# EAGLE design Amp Relay (EAGLE 9.4.0)
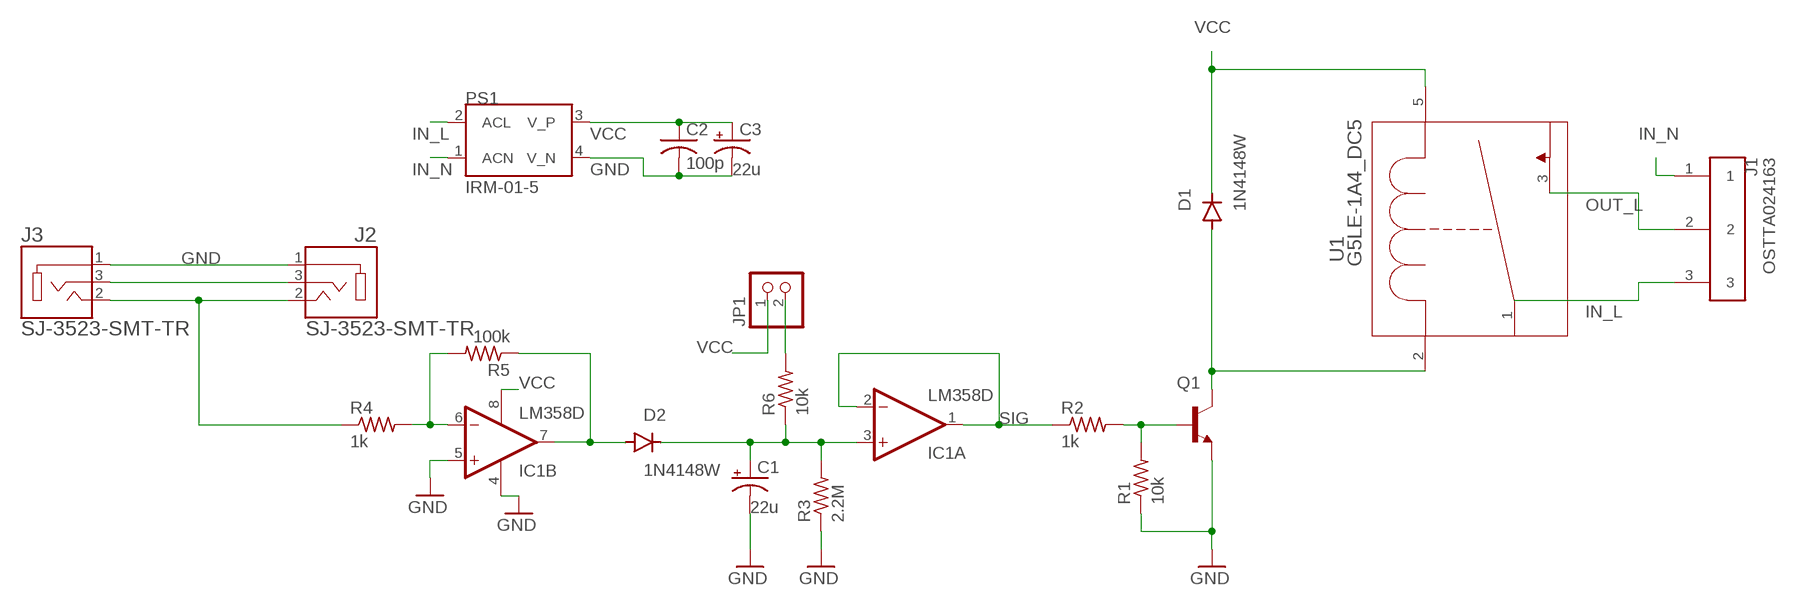
[diagram p0: schematic, sheet 1]

## Parts
C1  WE-CAP  [WE-CAP]
C2  100p  C-USC0805  [C0805]
C3  WE-CAP  [WE-CAP]
D1  1N4148W  DIODE-SOD123  [SOD123]
D2  1N4148W  DIODE-SOD123  [SOD123]
IC1  LM358D  [SO08]
J1  OSTTA024163  [OSTTA024163]
J2  SJ-3523-SMT-TR  [CUI_SJ-3523-SMT-TR]
J3  SJ-3523-SMT-TR  [CUI_SJ-3523-SMT-TR]
JP1  PINHD-1X2  [1X02]
PS1  IRM-01-5  [CONV_IRM-01-5]
Q1  BC849SMD  [SOT23-BEC]
R1  10k  R-US_R1206  [R1206]
R2  1k  R-US_R0805  [R0805]
R3  2.2M  R-US_R1206  [R1206]
R4  1k  R-US_R0805  [R0805]
R5  100k  R-US_R1206  [R1206]
R6  10k  R-US_R1206  [R1206]
U1  G5LE-1A4_DC5  [RELAY_G5LE-1A]

## Nets
B: Q1.B R1.2 R2.2
C: D1.A Q1.C U1.2
GND: C1.- C2.2 C3.- IC1.4(P:V-) IC1.5(B:+IN) J2.1 J3.1 PS1.4(V_N) Q1.E R1.1 R3.1
IN_L: J1.3 PS1.2(ACL) U1.1
IN_N: J1.1 PS1.1(ACN)
N$1: JP1.2 R6.2
N$2: J2.2 J3.2 R4.1
N$3: IC1.6(B:-IN) R4.2 R5.2
N$4: D2.A IC1.7(B:OUT) R5.1
N$5: C1.+ D2.C IC1.3(A:+IN) R3.2 R6.1
N$6: J2.3 J3.3
OUT_L: J1.2 U1.3
SIG: IC1.1(A:OUT) IC1.2(A:-IN) R2.1
VCC: C2.1 C3.+ D1.C IC1.8(P:V+) JP1.1 PS1.3(V_P) U1.5

## Library data of the parts
C1 C3 = my_lib:WE-CAP; C: 22u
C2 = rcl:C-US: CAPACITOR, American symbol; SPICEPREFIX: C
D1 D2 = diode:DIODE-: DIODE
IC1 = linear:LM358: OP AMP also LM158; LM258; LM2904 Source: http://cache.national.com/ds/LM/LM158.pdf
J1 = my_lib:OSTTA024163: 3-pin terminal block
J2 J3 = my_lib:SJ-3523-SMT-TR: Audio Jack Connector 3.5 mm Low Profile Surface Mount Stereo Jack, 3 Pin Right-Angle; CUI_PURCHASE_URL: https://www.cui.com/product/interconnect/audio-connectors/3.5-mm-jacks/sj-352x-smt-series?utm_source=snapeda.com&utm_medium=referral&utm_campaign=snapedaBOM; DESCRIPTION: SJ Series 3.5 mm 12 V SMT Right Angle Stereo Audio Jack; DIGI-KEY_PART_NUMBER: CP-3523SJCT-ND; DIGI-KEY_PURCHASE_URL: https://www.digikey.com/product-detail/en/cui-inc/SJ-3523-SMT-TR/CP-3523SJCT-ND/669704?utm_source=snapeda&utm_medium=aggregator&utm_campaign=symbol; MF: CUI Inc.; MP: SJ-3523-SMT-TR; PACKAGE: LGA-10 STMicroelectronics
JP1 = pinhead:PINHD-1X2: PIN HEADER
PS1 = my_lib:IRM-01-5: AC-DC Single Output Encapsulated power supply; Input 85-305Vac; Output 5Vdc at 0.2A; PCB mount; DESCRIPTION: AC-DC Single Output Encapsulated power supply; Input 85-305Vac; Output 5Vdc at 0.2A; PCB mount; DIGI-KEY_PART_NUMBER: 1866-2998-ND; DIGI-KEY_PURCHASE_URL: https://www.digikey.com/product-detail/en/mean-well-usa-inc/IRM-01-5/1866-2998-ND/7704616?utm_source=snapeda&utm_medium=aggregator&utm_campaign=symbol; MF: MEAN WELL; MP: IRM-01-5; PACKAGE: DIP-4 Mean Well
Q1 = transistor-npn:BC849*: NPN Transistor
R1-R6 = rcl:R-US_: RESISTOR, American symbol; SPICEPREFIX: R
U1 = my_lib:G5LE-1A4_DC5; MANUFACTURER_PART_NUMBER: G5LE1A4 DC5; VENDOR: OMRON

## Board
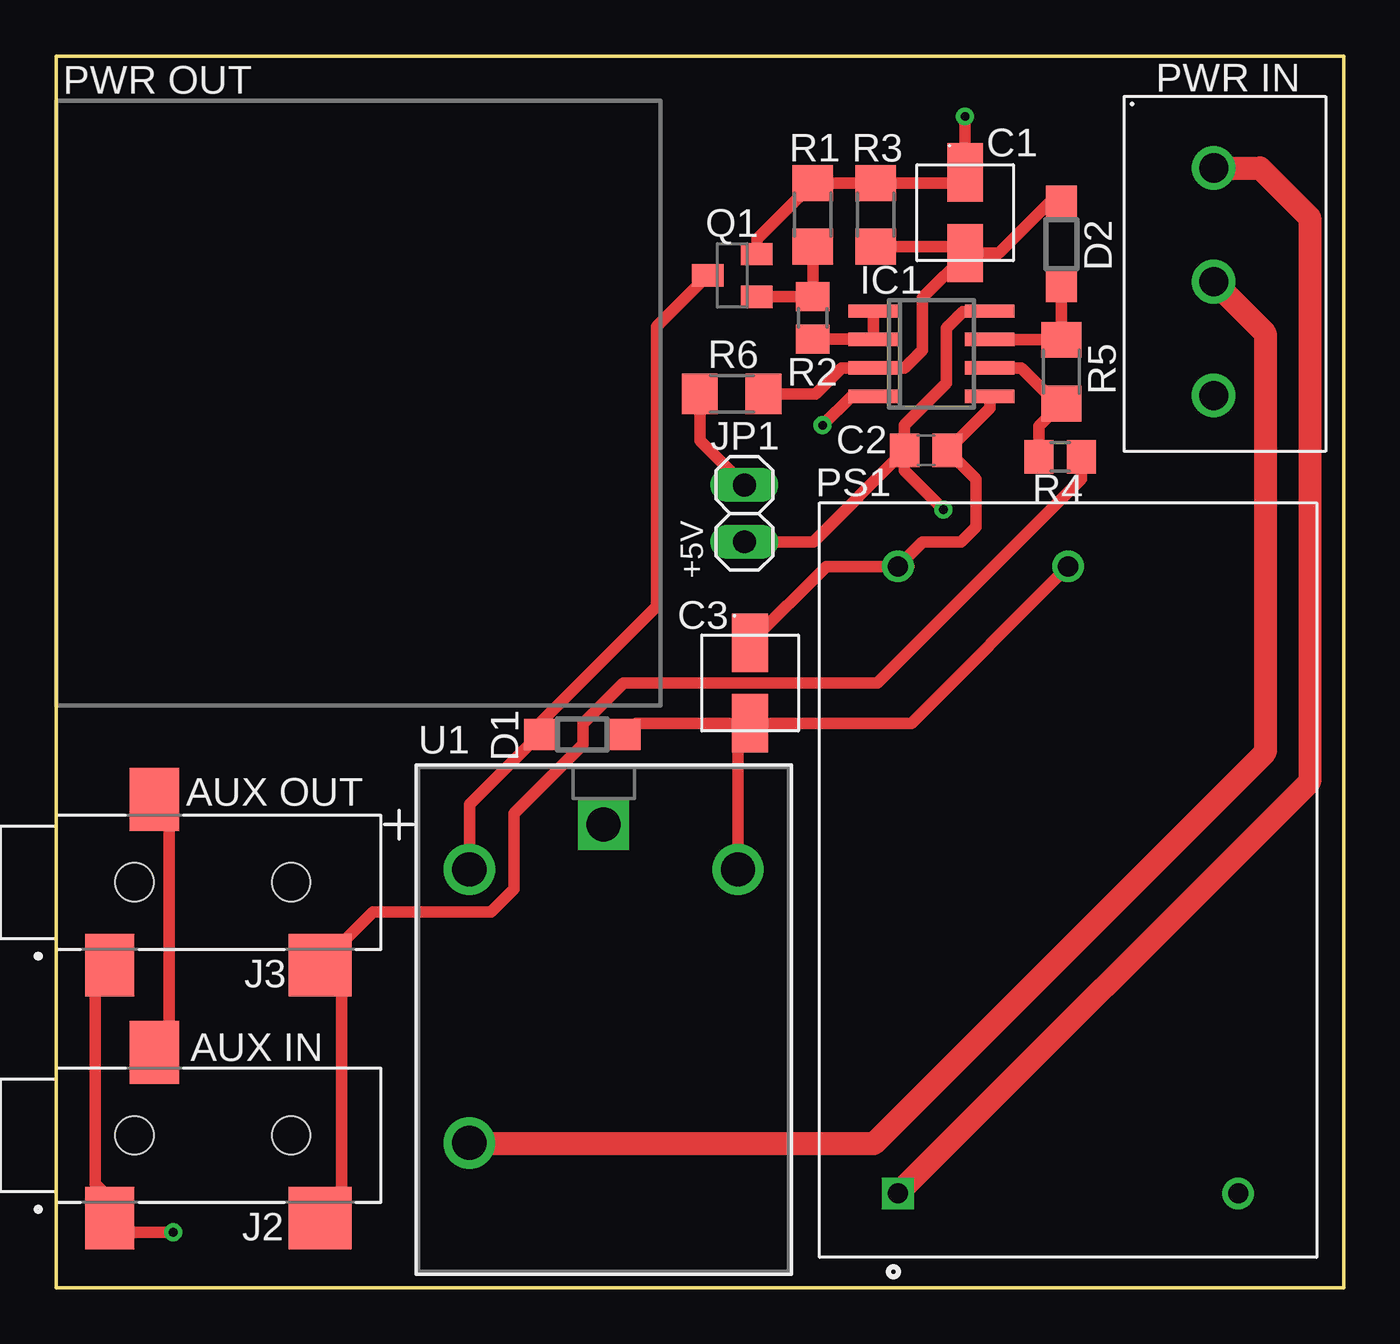
[diagram p1: board, top side]
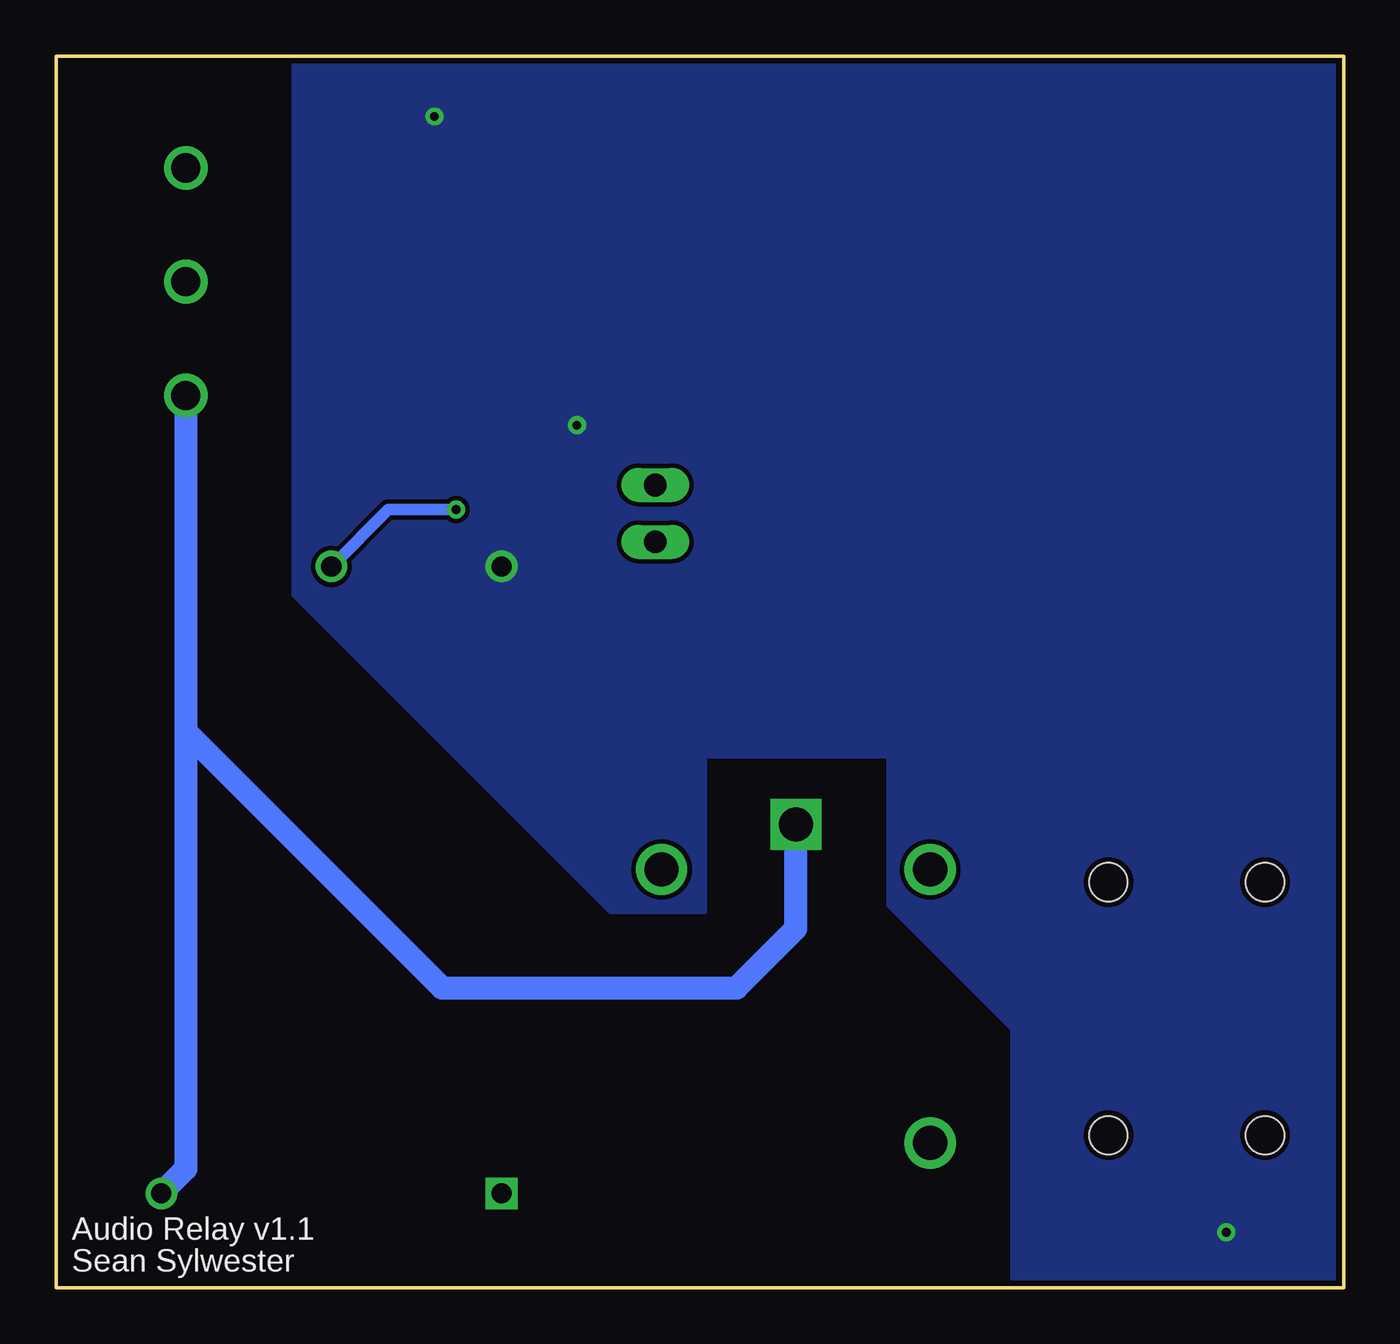
[diagram p2: board, bottom side, seen from below]

Size 57.5 x 55 mm. Coordinates in mm from the lower left corner, seen from the top.
Outline: 0,0 0,55 57.5,55 57.5,0 0,0
Copper layers (1*16): Top 0.035mm / dielectric 1.5mm / Bottom 0.035mm
Design rules "adafruit": minimum track width 8mil, minimum drill 15.5mil, track to track 8mil, track to pad 8mil, pad to pad 8mil, via to via 8mil, smd to smd 8mil, copper to edge 10mil, drill to drill 8mil, minimum pad ring 10mil, minimum via ring 8mil, stop-mask expansion 2mil, vias tented up to drill 20mil, thermal gap 10mil

### Footprints (pad centres in the part's own frame; a part is rotated, then mirrored left to right if it is on the bottom)
WE-CAP = smd 2.6 x 1.6: + 1.8,0; - -1.8,0
C0805 = smd 1.3 x 1.5: 1 -0.95,0; 2 0.95,0
SOD123 = smd 1.4 x 1.4: A 1.9,0; C -1.9,0
SO08 = smd 0.6 x 2.2: 1 -1.905,-2.6; 2 -0.635,-2.6; 3 0.635,-2.6; 4 1.905,-2.6; 5 1.905,2.6; 6 0.635,2.6; 7 -0.635,2.6; 8 -1.905,2.6
OSTTA024163 = drill 1.3: 1 3.2,4; 2 8.28,4; 3 13.36,4
CUI_SJ-3523-SMT-TR = smd 2.2 x 2.8: 1 -1.1,-3.7; 3 0.9,3.7 | smd 2.8 x 2.8: 2 8.3,-3.7 | hole 1.7: 0,0; 7,0
1X02 = drill 1.016 long: 1 -1.27,0; 2 1.27,0
CONV_IRM-01-5 = drill 0.9 square: 1 -14,7.6 | drill 0.9: 2 -14,-7.6; 3 14,0; 4 14,7.6
SOT23-BEC = smd 1 x 1.4: B -0.95,-1.1; C 0,1.1; E 0.95,-1.1
R1206 = smd 1.6 x 1.803: 1 -1.422,0; 2 1.422,0
R0805 = smd 1.3 x 1.5: 1 -0.95,0; 2 0.95,0
RELAY_G5LE-1A = drill 1.524 pad 2.032 square: 1 0,17.424 | drill 1.524 pad 2.032: 2 -5.994,15.418; 3 -5.994,3.2; 5 5.994,15.418

### Placement (x,y rotation side)
C1  40.6,48 270 top
C2  38.85,37.39 0 top
C3  31,27 270 top
D1  23.5,24.7 180 top
D2  44.9,46.6 270 top
IC1  39.1,41.7 270 top
J1  47.7,53.2 270 top
J2  3.5,6.8 0 top
J3  3.5,18.1 0 top
JP1  30.74,34.57 90 top
PS1  45.2,18.2 90 top
Q1  30.2,45.2 90 top
R1  33.8,47.9 270 top
R2  33.8,43.3 90 top
R3  36.6,47.9 270 top
R4  44.85,37.1 180 top
R5  44.9,40.9 270 top
R6  30.18,39.9 180 top
U1  24.46,3.25 0 top

### Tracks (layer width: path | path; a pad name or v marks a point on that pad's centre or on a via)
B
  Top 0.508: R1.2 R2.2 Q1.B
C
  Top 0.508: U1.2 18.46,21.56 D1.A 21.6,25.2 26.82,30.42 26.82,42.92 Q1.C
GND  (via drill 0.39)
  Top 0.508: R3.1 37.08,49.8 | C3.- 34.4,32.2 PS1.4 | PS1.4 38.1,32.2 | R3.1 40.12,49.32 C1.- v40.6,52.3 | R3.1 R1.1 31.3,46.82 Q1.E | 36.49,39.81 IC1.4 35.53,39.8 v34.24,38.51 | J3.1 1.74,13.74 1.74,4.64 2.4,3.98 J2.1 3.04,2.46 v5.23,2.46 | IC1.5 41.7,39.28 C2.2 41.08,36.11 41.08,33.95 40.42,33.29 38.69,33.29 PS1.4
  pour Bottom (no thermals): 0.1,54.9 46.9,54.9 46.9,30.9 32.75,16.75 28.5,16.75 28.5,23.7 20.35,23.7 20.35,17.05 14.8,11.5 14.8,0.15 0.1,0.15
IN_L
  Bottom 1.016: PS1.2 51.7,5.3 J1.3 51.7,24.82 40.26,13.38 27.11,13.38 24.46,16.03 U1.1
IN_N
  Top 1.016: J1.1 53.78,50 55.99,47.79 55.99,22.59 PS1.1
N$1
  Top 0.508: JP1.2 28.75,37.83 R6.2
N$2
  Top 0.508: J2.2 11.8,3.28 12.76,4.24 12.76,13.44 J3.2 14.17,16.77 19.43,16.77 20.46,17.81 20.46,21.17 23.54,24.25 23.54,25.19 25.35,26.99 36.69,26.99 45.8,36.1 R4.1
N$3
  Top 0.508: R4.2 43.9,38.48 R5.2 44.7,39.48 43.11,41.06 IC1.6
N$4
  Top 0.508: D2.A R5.1 44.89,42.34 IC1.7
N$5
  Top 0.508: R3.2 40.32,46.48 C1.+ 40.7,46.2 | 40.7,46.2 42.1,46.2 44.4,48.5 D2.C | 40.7,46.2 38.7,44.2 38.7,41.87 37.9,41.06 IC1.3 35.07,41.06 33.91,39.9 R6.1
N$6
  Top 0.508: J3.3 5.06,21.14 5.06,11.16 J2.3
OUT_L
  Top 1.016: J1.2 54,42.62 54,23.9 36.52,6.42 18.5,6.42 U1.3
SIG
  Top 0.508: R2.1 36.48,42.35 IC1.2 IC1.1
VCC  (via drill 0.39)
  Top 0.508: IC1.8 41.69,43.59 40.51,43.59 39.77,42.85 39.77,40.38 37.9,38.51 C2.1 | D1.C 25.9,25.2 C3.+ | C3.+ 38.2,25.2 PS1.3 | U1.5 30.45,24.65 C3.+ | C2.1 33.82,33.3 JP1.1 | C2.1 37.9,36.48 v39.64,34.74
  Bottom 0.508: PS1.3 42.66,34.74 v39.64,34.74

### Text on the board
tPlace: PWR OUT | PWR IN | +5V | AUX OUT | AUX IN
bPlace: Audio Relay v1.1 | Sean Sylwester